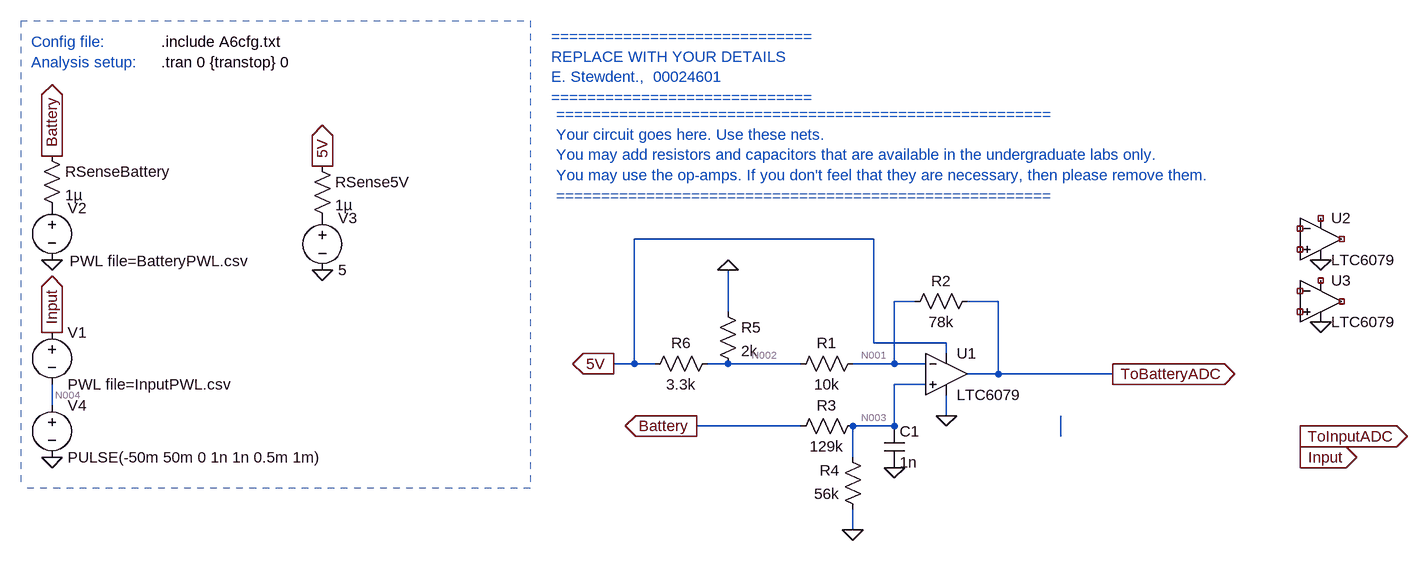
[diagram p0: schematic E344_22897828_A6.asc]
E344_22897828_A6.asc, the LTspice schematic file:
Version 4
SHEET 1 1824 680
WIRE -1056 -1088 -1424 -1088
WIRE -992 -992 -1024 -992
WIRE -864 -992 -912 -992
WIRE -1280 -976 -1280 -1040
WIRE -1056 -928 -1056 -1088
WIRE -944 -928 -1056 -928
WIRE -944 -912 -944 -928
WIRE -1424 -896 -1424 -1088
WIRE -1424 -896 -1456 -896
WIRE -1392 -896 -1424 -896
WIRE -1280 -896 -1312 -896
WIRE -1168 -896 -1280 -896
WIRE -1024 -896 -1024 -992
WIRE -1024 -896 -1088 -896
WIRE -976 -896 -1024 -896
WIRE -864 -880 -864 -992
WIRE -864 -880 -912 -880
WIRE -688 -880 -864 -880
WIRE -976 -864 -1024 -864
WIRE -2320 -832 -2320 -864
WIRE -944 -816 -944 -848
WIRE -1168 -800 -1328 -800
WIRE -1024 -800 -1024 -864
WIRE -1024 -800 -1088 -800
WIRE -768 -784 -768 -816
WIRE -1088 -752 -1088 -800
WIRE -1088 -640 -1088 -672
FLAG -2320 -944 Input
IOPIN -2320 -944 Out
FLAG -1904 -1040 0
FLAG -1088 -640 0
FLAG -2320 -752 0
FLAG -2320 -1056 0
FLAG -400 -784 ToInputADC
IOPIN -400 -784 Out
FLAG -688 -880 ToBatteryADC
IOPIN -688 -880 Out
FLAG -1904 -1200 5V
IOPIN -1904 -1200 Out
FLAG -2320 -1216 Battery
IOPIN -2320 -1216 Out
FLAG -1328 -800 Battery
IOPIN -1328 -800 Out
FLAG -400 -752 Input
IOPIN -400 -752 Out
FLAG -1456 -896 5V
IOPIN -1456 -896 Out
FLAG -368 -960 0
FLAG -368 -1056 0
FLAG -944 -816 0
FLAG -1280 -1040 0
FLAG -1024 -736 0
SYMBOL voltage -2320 -960 R0
WINDOW 123 0 0 Left 0
WINDOW 39 0 0 Left 0
SYMATTR InstName V1
SYMATTR Value PWL file=InputPWL.csv
SYMBOL voltage -2320 -1152 R0
WINDOW 123 0 0 Left 0
WINDOW 39 0 0 Left 0
WINDOW 3 27 98 Left 2
SYMATTR Value PWL file=BatteryPWL.csv
SYMATTR InstName V2
SYMBOL voltage -1904 -1136 R0
WINDOW 123 0 0 Left 0
WINDOW 39 0 0 Left 0
SYMATTR InstName V3
SYMATTR Value 5
SYMBOL voltage -2320 -848 R0
WINDOW 123 0 0 Left 0
WINDOW 39 0 0 Left 0
SYMATTR InstName V4
SYMATTR Value PULSE(-50m 50m 0 1n 1n 0.5m 1m)
SYMBOL res -1920 -1216 R0
SYMATTR InstName RSense5V
SYMATTR Value 1µ
SYMBOL res -2336 -1232 R0
SYMATTR InstName RSenseBattery
SYMATTR Value 1µ
SYMBOL OpAmps\\LTC6079 -944 -880 R0
SYMATTR InstName U1
SYMBOL OpAmps\\LTC6079 -368 -1088 R0
SYMATTR InstName U2
SYMBOL OpAmps\\LTC6079 -368 -992 R0
SYMATTR InstName U3
SYMBOL res -1072 -912 R90
WINDOW 0 0 56 VBottom 2
WINDOW 3 32 56 VTop 2
SYMATTR InstName R1
SYMATTR Value 10k
SYMBOL res -896 -1008 R90
WINDOW 0 0 56 VBottom 2
WINDOW 3 32 56 VTop 2
SYMATTR InstName R2
SYMATTR Value 78k
SYMBOL res -1072 -816 R90
WINDOW 0 0 56 VBottom 2
WINDOW 3 32 56 VTop 2
SYMATTR InstName R3
SYMATTR Value 129k
SYMBOL res -1072 -656 R180
WINDOW 0 36 76 Left 2
WINDOW 3 36 40 Left 2
SYMATTR InstName R4
SYMATTR Value 56k
SYMBOL res -1296 -992 R0
SYMATTR InstName R5
SYMATTR Value 2k
SYMBOL res -1296 -912 R90
WINDOW 0 0 56 VBottom 2
WINDOW 3 32 56 VTop 2
SYMATTR InstName R6
SYMATTR Value 3.3k
SYMBOL cap -1040 -800 R0
SYMATTR InstName C1
SYMATTR Value 1n
TEXT -2152 -1360 Left 2 !.tran 0 {transtop} 0
TEXT -2152 -1392 Left 2 !.include A6cfg.txt
TEXT -2352 -1392 Left 2 ;Config file:
TEXT -2352 -1360 Left 2 ;Analysis setup:
TEXT -1552 -1400 Left 2 ;=============================\nREPLACE WITH YOUR DETAILS\nE. Stewdent.,  00024601\n=============================
TEXT -1544 -1280 Left 2 ;=======================================================\nYour circuit goes here. Use these nets.\nYou may add resistors and capacitors that are available in the undergraduate labs only.\nYou may use the op-amps. If you don't feel that they are necessary, then please remove them.\n=======================================================
LINE Normal -1584 -1424 -1584 -704 2
LINE Normal -2368 -1424 -1584 -1424 2
LINE Normal -1584 -704 -2368 -704 2
LINE Normal -1584 -720 -1584 -720 2
LINE Normal -2368 -1424 -2368 -704 2

The netlist it stands for:
* E344_22897828_A6.asc
V1 Input N004 PWL file=InputPWL.csv
V2 P001 0 PWL file=BatteryPWL.csv
V3 P002 0 5
V4 N004 0 PULSE(-50m 50m 0 1n 1n 0.5m 1m)
RSense5V 5V P002 1µ
RSenseBattery Battery P001 1µ
XU1 N003 N001 5V 0 ToBatteryADC LTC6078  ; LTC6079, pins In+ In- V+ V- OUT
XU2 NC_01 NC_02 NC_03 0 NC_04 LTC6078  ; LTC6079, pins In+ In- V+ V- OUT
XU3 NC_05 NC_06 NC_07 0 NC_08 LTC6078  ; LTC6079, pins In+ In- V+ V- OUT
R1 N001 N002 10k
R2 ToBatteryADC N001 78k
R3 N003 Battery 129k
R4 0 N003 56k
R5 0 N002 2k
R6 N002 5V 3.3k
C1 N003 0 1n
.tran 0 {transtop} 0
.include A6cfg.txt
* Config file:
* Analysis setup:
* =============================
* REPLACE WITH YOUR DETAILS
* E. Stewdent.,  00024601
* =============================
* =======================================================
* Your circuit goes here. Use these nets.
* You may add resistors and capacitors that are available in the undergraduate labs only.
* You may use the op-amps. If you don't feel that they are necessary, then please remove them.
* =======================================================
.lib LTC5.lib
.backanno
.end

* Results of the author's LTspice run, read from the files saved beside the schematic
* Operating Point, zero values left out:
*   V(input) = -50 mV
*   V(n004) = -50 mV
*   V(p001) = 5.7 V
*   V(p002) = 5 V
*   V(5v) = 5 V
*   V(battery) = 5.7 V
*   V(n003) = 1.725 V
*   V(n001) = 1.725 V
*   V(tobatteryadc) = 606 mV
*   V(n002) = 1.869 V
*   I(R6) = -948.8 µA
*   I(R5) = -934.5 µA
*   I(R4) = -30.81 µA
*   I(R3) = -30.81 µA
*   I(R2) = -14.35 µA
*   I(R1) = -14.35 µA
*   I(Rsensebattery) = -30.81 µA
*   I(Rsense5v) = -998.2 µA
*   I(V3) = -998.2 µA
*   I(V2) = -30.81 µA
*   Ix(u1:3) = 49.35 µA
*   Ix(u1:4) = -63.7 µA
*   Ix(u1:5) = 14.35 µA
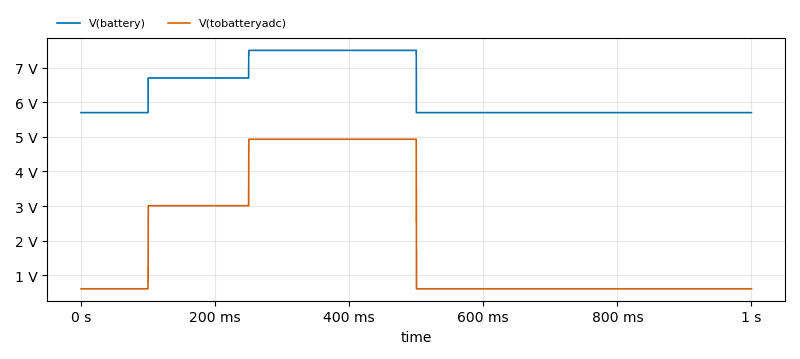
[diagram p1: Transient Analysis of E344_22897828_A6.asc, plotted from the saved traces]
* Transient Analysis, 1 run:
*   V(battery): min 5.7 V, max 7.5 V, average 6.3 V, rms 6.347 V, last 5.7 V
*   V(tobatteryadc): min 606 mV, max 4.93 V, average 2.047 V, rms 2.767 V, last 606 mV